# EAGLE design UniversalBoardBreakout_Pogo (EAGLE 9.0.1)
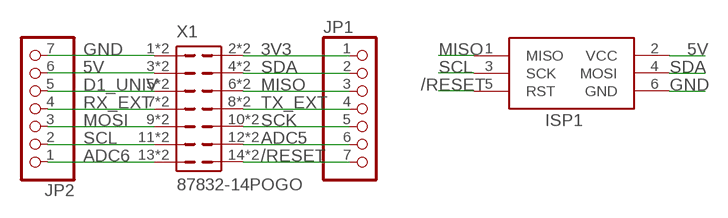
[diagram p0: schematic, sheet 1]

## Parts
ISP1  AVRISP-6  [AVRISP]
JP1  CONN_7  [1X07]
JP2  CONN_7  [1X07]
X1  87832-14POGO  [87832-14_POGO]

## Nets
3V3: JP1.1 X1.2 X1.P2
5V: ISP1.2(VCC) JP2.6 X1.3 X1.P3
/RESET: ISP1.5(RST) JP1.7 X1.14 X1.P14
ADC5: JP1.6 X1.12 X1.P12
ADC6: JP2.1 X1.13 X1.P13
D1_UNIV: JP2.5 X1.5 X1.P5
GND: ISP1.6(GND) JP2.7 X1.1 X1.P1
MISO: ISP1.1(MISO) JP1.3 X1.6 X1.P6
MOSI: JP2.3 X1.9 X1.P9
RX_EXT: JP2.4 X1.7 X1.P7
SCK: JP1.5 X1.10 X1.P10
SCL: ISP1.3(SCK) JP2.2 X1.11 X1.P11
SDA: ISP1.4(MOSI) JP1.2 X1.4 X1.P4
TX_EXT: JP1.4 X1.8 X1.P8

## Library data of the parts
ISP1 = bschulz:AVRISP: AVR ISP HEADER Standard 6 pin header for AVR programming
JP1 JP2 = bschulz:CONN_7: PIN HEADER
X1 = bschulz:87832-14: Milli-Grid Header 2.00mm (.079") Pitch

## Board
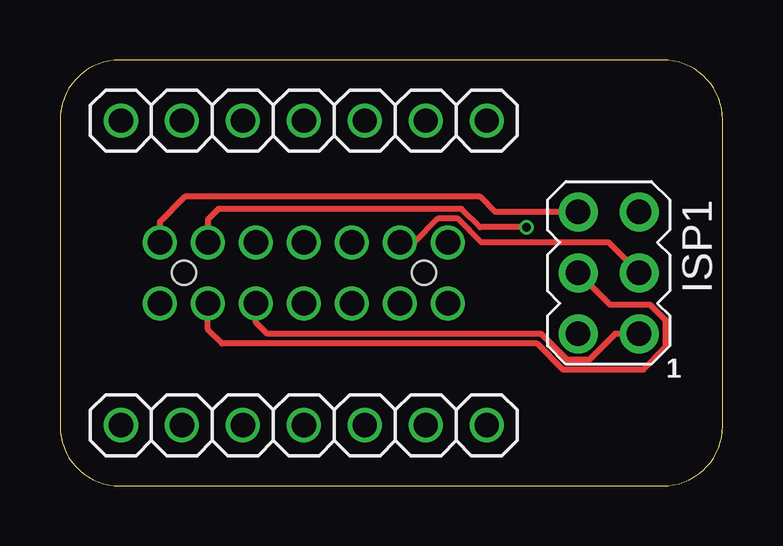
[diagram p1: board, top side]
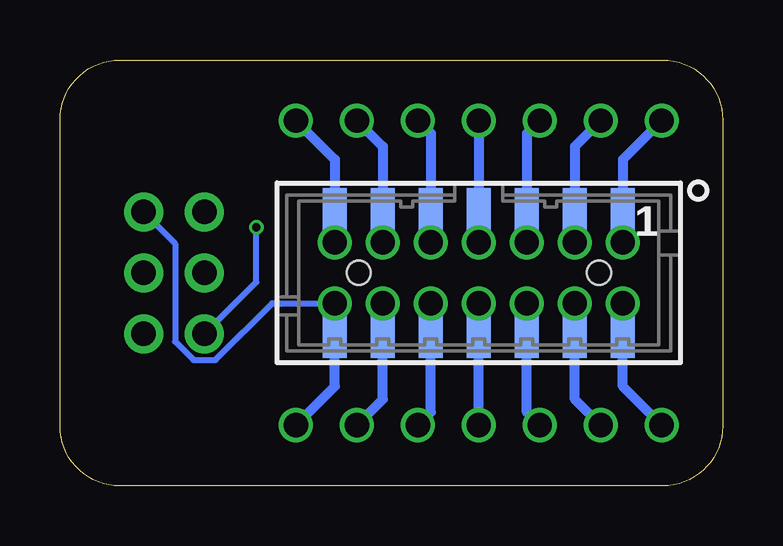
[diagram p2: board, bottom side, seen from below]

Size 27.61 x 17.77 mm. Coordinates in mm from the lower left corner, seen from the top.
Outline: 0,15.27 0,2.5 arc90 2.5,0 25.11,0 arc90 27.61,2.5 27.61,15.27 arc90 25.11,17.77 2.5,17.77 arc90 0,15.27
Copper layers (1*16): Top 0.035559375mm / dielectric 1.6mm / Bottom 0.035559375mm
Design rules "oshpark-2layer *": minimum track width 6mil, minimum drill 10mil, track to track 6mil, track to pad 6mil, pad to pad 6mil, via to via 6mil, smd to smd 6mil, copper to edge 15mil, drill to drill 6mil, minimum pad ring 5mil, minimum via ring 5mil, stop-mask expansion 2.5mil, vias tented up to drill 0mil, thermal gap 10mil

### Footprints (pad centres in the part's own frame; a part is rotated, then mirrored left to right if it is on the bottom)
AVRISP = drill 1.02 pad 1.626: 1 -1.27,2.54; 2 1.27,2.54; 3 -1.27,0; 4 1.27,0; 5 -1.27,-2.54; 6 1.27,-2.54
1X07 = drill 1.016: 1 -7.62,0; 2 -5.08,0; 3 -2.54,0; 4 0,0; 5 2.54,0; 6 5.08,0; 7 7.62,0
87832-14_POGO = smd 1 x 1.75: 1 -6,-2.667; 2 -6,2.667; 3 -4,-2.667; 4 -4,2.667; 5 -2,-2.667; 6 -2,2.667; 7 0,-2.667; 8 0,2.667; 9 2,-2.667; 10 2,2.667; 11 4,-2.667; 12 4,2.667; 13 6,-2.667; 14 6,2.667 | drill 1.016 pad 1.422: P1 -6,-1.27; P2 -6,1.27; P3 -4,-1.27; P4 -4,1.27; P5 -2,-1.27; P6 -2,1.27; P7 0,-1.27; P8 0,1.27; P9 2,-1.27; P10 2,1.27; P11 4,-1.27; P12 4,1.27; P13 6,-1.27; P14 6,1.27 | hole 1: -5,0; 5,0

### Placement (x,y rotation side)
ISP1  22.86,8.89 180 top
JP1  10.16,2.54 0 top
JP2  10.16,15.24 180 top
X1  10.16,8.89 180 bottom

### Tracks (layer width: path | path; a pad name or v marks a point on that pad's centre or on a via)
3V3
  Bottom 0.406: X1.2 X1.P2 4.16,4.16 JP1.1
5V  (via drill 0.35)
  Top 0.254: v19.43,10.79 17.5,10.79 16.74,11.56 6.6,11.56 6.16,11.11 X1.P3
  Bottom 0.254: ISP1.2 19.43,8.51 v19.43,10.79
  Bottom 0.406: X1.3 X1.P3 6.16,14.16 JP2.6
/RESET
  Bottom 0.254: ISP1.5 22.81,10.11 22.81,6.03 22.04,5.26 21.14,5.26 18.77,7.62 X1.P14
  Bottom 0.406: X1.14 X1.P14 16.16,4.16 JP1.7
ADC5
  Bottom 0.406: X1.12 X1.P12 14.16,3.62 JP1.6
ADC6
  Bottom 0.406: X1.13 X1.P13 16.16,13.62 JP2.1
D1_UNIV
  Bottom 0.406: X1.5 X1.P5 8.16,14.7 JP2.5
GND
  Top 0.254: ISP1.6 18.14,11.43 17.5,12.06 5.21,12.06 4.16,11.02 X1.P1
  Bottom 0.406: X1.1 X1.P1 4.16,13.62 JP2.7
MISO
  Top 0.254: ISP1.1 23.14,6.35 22.04,5.26 21.14,5.26 20.05,6.35 8.64,6.35 8.16,6.83 X1.P6
  Bottom 0.406: X1.6 X1.P6 8.16,3.08 JP1.3
MOSI
  Bottom 0.406: X1.9 X1.P9 12.16,14.7 JP2.3
RX_EXT
  Bottom 0.406: X1.7 X1.P7 JP2.4
SCK
  Bottom 0.406: X1.10 X1.P10 12.16,3.08 JP1.5
SCL
  Top 0.254: ISP1.3 22.86,10.16 17.56,10.16 16.57,11.15 15.75,11.15 14.76,10.16 X1.P11
  Bottom 0.406: X1.11 X1.P11 14.16,14.16 JP2.2
SDA
  Top 0.254: ISP1.4 22.91,7.57 24.58,7.57 25.22,6.93 25.22,5.77 24.3,4.85 20.97,4.85 19.88,5.94 6.76,5.94 6.16,6.54 X1.P4
  Bottom 0.406: X1.4 X1.P4 6.16,3.62 JP1.2
TX_EXT
  Bottom 0.406: X1.8 X1.P8 JP1.4

### Text on the board
tDocu: Northern Widget / Bobby Schulz
bDocu: GND | 5V | D1 | RX | MOSI | SCL | ADC6 | Universal / Breakout | 3v3 | SDA | MISO | TX | SCK | ADC5 | RST